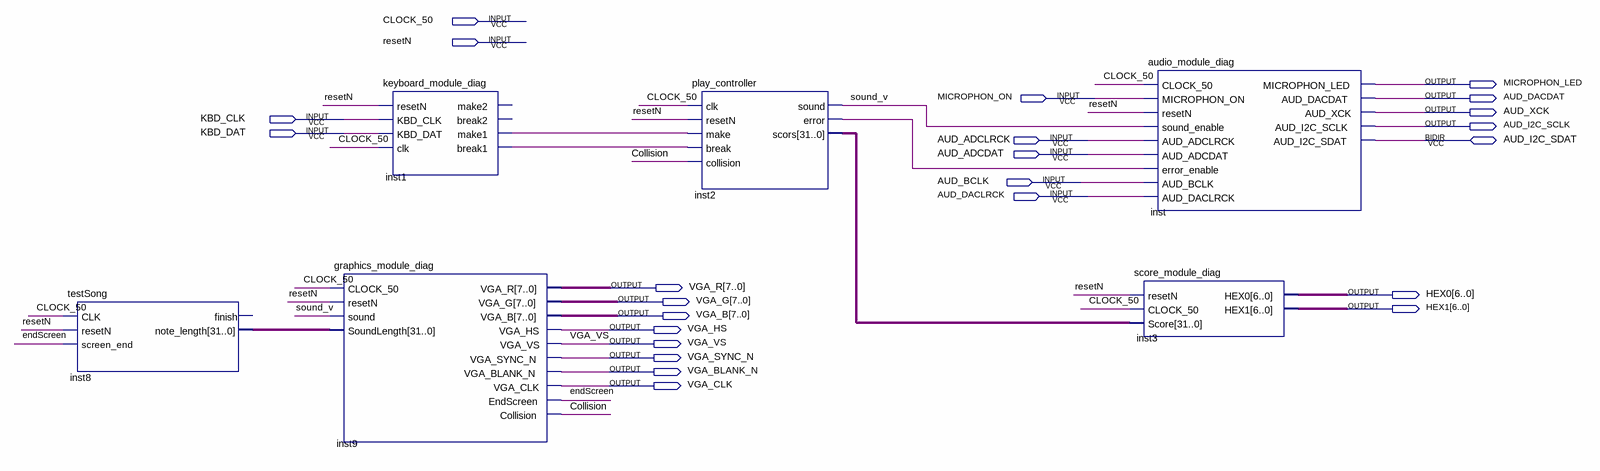
[diagram p0: schematic sheet]
// Quartus schematic TOP_module_diag.bdf as structural Verilog: 6 symbols, 24 pins
module TOP_module_diag (
  input  CLOCK_50,
  input  resetN,
  input  MICROPHON_ON,
  input  KBD_CLK,
  input  KBD_DAT,
  input  AUD_ADCLRCK,
  input  AUD_ADCDAT,
  input  AUD_BCLK,
  input  AUD_DACLRCK,
  inout  AUD_I2C_SDAT,
  output MICROPHON_LED,
  output AUD_DACDAT,
  output AUD_XCK,
  output AUD_I2C_SCLK,
  output [7:0] VGA_R,
  output [6:0] HEX0,
  output [7:0] VGA_G,
  output [6:0] HEX1,
  output [7:0] VGA_B,
  output VGA_HS,
  output VGA_VS,
  output VGA_SYNC_N,
  output VGA_BLANK_N,
  output VGA_CLK
);

  wire Collision, endScreen, inst1_break1, inst1_make1, inst2_error, sound_v;
  wire [31:0] inst2_scors, inst8_note_length;

  testSong inst8 (
    .CLK(CLOCK_50), .resetN(resetN), .screen_end(endScreen), .note_length(inst8_note_length));  // open: finish
  graphics_module_diag inst9 (
    .CLOCK_50(CLOCK_50), .resetN(resetN), .sound(sound_v), .SoundLength(inst8_note_length), .VGA_R(VGA_R),
    .VGA_G(VGA_G), .VGA_B(VGA_B), .VGA_HS(VGA_HS), .VGA_VS(VGA_VS), .VGA_SYNC_N(VGA_SYNC_N),
    .VGA_BLANK_N(VGA_BLANK_N), .VGA_CLK(VGA_CLK), .EndScreen(endScreen), .Collision(Collision));
  keyboard_module_diag inst1 (
    .resetN(resetN), .KBD_CLK(KBD_CLK), .KBD_DAT(KBD_DAT), .clk(CLOCK_50), .make1(inst1_make1),
    .break1(inst1_break1));  // open: make2, break2
  play_controller inst2 (
    .clk(CLOCK_50), .resetN(resetN), .make(inst1_make1), .\break (inst1_break1), .collision(Collision),
    .sound(sound_v), .error(inst2_error), .scors(inst2_scors));
  score_module_diag inst3 (.resetN(resetN), .CLOCK_50(CLOCK_50), .Score(inst2_scors), .HEX0(HEX0), .HEX1(HEX1));
  audio_module_diag inst (
    .CLOCK_50(CLOCK_50), .MICROPHON_ON(MICROPHON_ON), .resetN(resetN), .sound_enable(sound_v),
    .AUD_ADCLRCK(AUD_ADCLRCK), .AUD_ADCDAT(AUD_ADCDAT), .error_enable(inst2_error), .AUD_BCLK(AUD_BCLK),
    .AUD_DACLRCK(AUD_DACLRCK), .MICROPHON_LED(MICROPHON_LED), .AUD_DACDAT(AUD_DACDAT), .AUD_XCK(AUD_XCK),
    .AUD_I2C_SCLK(AUD_I2C_SCLK), .AUD_I2C_SDAT(AUD_I2C_SDAT));
endmodule
